# EAGLE board QS18-30-1 (EAGLE 6.1)
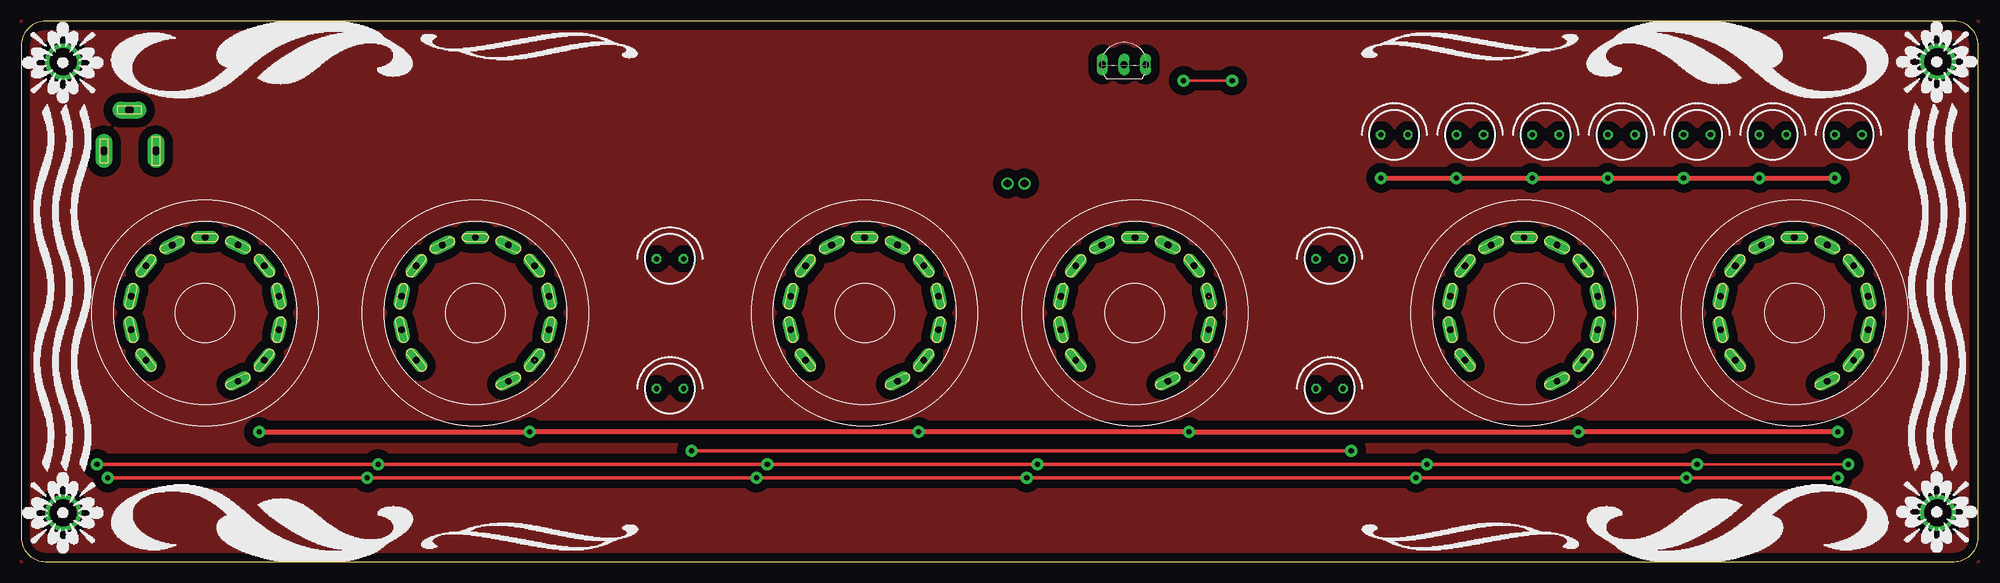
[diagram p1: board, top side]
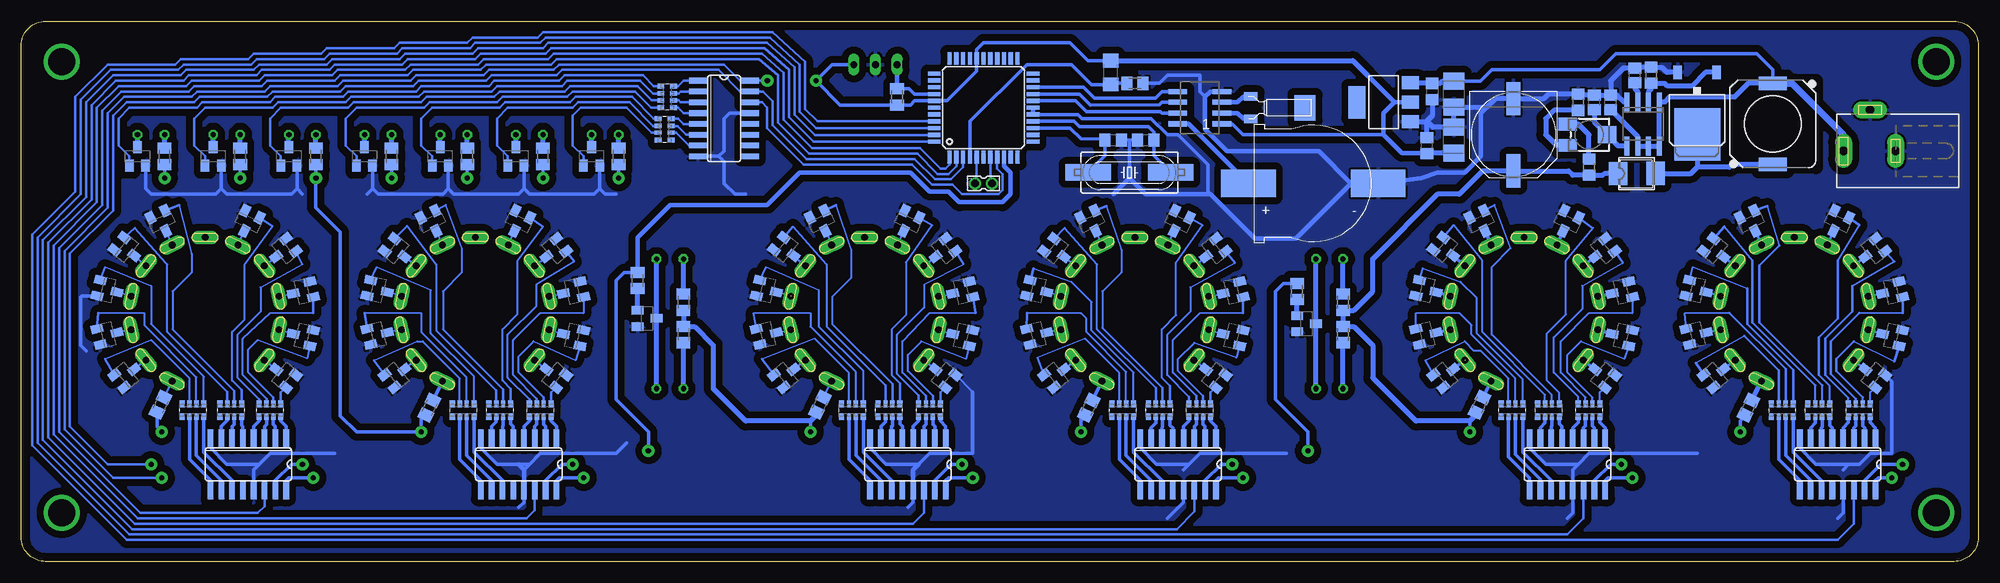
[diagram p2: board, bottom side, seen from below]

Size 229.87 x 63.5 mm. Coordinates in mm from the lower left corner, seen from the top.
Outline: 2.84,0 227.03,0 arc90 229.87,2.84 229.87,60.66 arc90 227.03,63.5 2.84,63.5 arc90 0,60.66 0,2.84 arc90 2.84,0
Copper layers (1*16): Top 0.035mm / dielectric 1.5mm / Bottom 0.035mm
Design rules: minimum track width 6mil, minimum drill 0.6mm, track to track 6mil, track to pad 10mil, pad to pad 10mil, via to via 10mil, smd to smd 6mil, copper to edge 40mil, drill to drill 8mil, minimum pad ring 10mil, minimum via ring 8mil, stop-mask expansion 4mil, vias tented up to drill 0.8mm, thermal gap 10mil
bRestrict: area 19.1,46.4 to 29.2,56.5

## Footprints (pad centres in the part's own frame; a part is rotated, then mirrored left to right if it is on the bottom)
C0805 = smd 1.3 x 1.5: 1 -0.85,0; 2 0.85,0
C1206 = smd 1.6 x 1.8: 1 -1.4,0; 2 1.4,0
C0805' = smd 1.3 x 1.5: 1 -0.95,0; 2 0.95,0
B/3528-21R = smd 1.95 x 2.5: + 1.525,0; - -1.525,0
PANASONIC_G = smd 3.9 x 1.6: + 4.25,0; - -4.25,0
SMB = smd 2.159 x 2.743: 1 -2.311,-0.127; 2 2.108,-0.102
SO16 = smd 0.66 x 2.032: 1 -4.445,-3.073; 2 -3.175,-3.073; 3 -1.905,-3.073; 4 -0.635,-3.073; 5 0.635,-3.073; 6 1.905,-3.073; 7 3.175,-3.073; 8 4.445,-3.073; 9 4.445,3.073; 10 3.175,3.073; 11 1.905,3.073; 12 0.635,3.073; 13 -0.635,3.073; 14 -1.905,3.073; 15 -3.175,3.073; 16 -4.445,3.073
SOIC8 = smd 0.6 x 2.2: 1 -1.905,-2.6; 2 -0.635,-2.6; 3 0.635,-2.6; 4 1.905,-2.6; 5 1.905,2.6; 6 0.635,2.6; 7 -0.635,2.6; 8 -1.905,2.6
DCJ0303 = drill 1 pad 2 long: 1 0,3.1; 2 4.8,0; 3 0,-3
DR1033 = smd 3.3 x 1.6: 1 0,4.768; 2 0,-4.768
TQFP44 = smd 1.5 x 0.5: 1 -5.8,4; 2 -5.8,3.2; 3 -5.8,2.4; 4 -5.8,1.6; 5 -5.8,0.8; 6 -5.8,0; 7 -5.8,-0.8; 8 -5.8,-1.6; 9 -5.8,-2.4; 10 -5.8,-3.2; 11 -5.8,-4; 23 5.8,-4; 24 5.8,-3.2; 25 5.8,-2.4; 26 5.8,-1.6; 27 5.8,-0.8; 28 5.8,0; 29 5.8,0.8; 30 5.8,1.6; 31 5.8,2.4; 32 5.8,3.2; 33 5.8,4 | smd 0.5 x 1.5: 12 -4,-5.8; 13 -3.2,-5.8; 14 -2.4,-5.8; 15 -1.6,-5.8; 16 -0.8,-5.8; 17 0,-5.8; 18 0.8,-5.8; 19 1.6,-5.8; 20 2.4,-5.8; 21 3.2,-5.8; 22 4,-5.8; 34 4,5.8; 35 3.2,5.8; 36 2.4,5.8; 37 1.6,5.8; 38 0.8,5.8; 39 0,5.8; 40 -0.8,5.8; 41 -1.6,5.8; 42 -2.4,5.8; 43 -3.2,5.8; 44 -4,5.8
IN-3 = drill 0.6 octagon: A -1.587,0; K 1.587,0
HC49UP = smd 5.334 x 1.93: 1 -4.826,0; 2 4.826,0
D-PAK_TO252AA = smd 1 x 1.6: 1 -2.28,-4.8; 3 2.28,-4.8 | smd 5.4 x 6.2: 4 0,2.5
EXB38V = smd 0.6 x 0.8: 1 -1.275,-0.75; 4 1.275,-0.75; 5 1.275,0.75; 8 -1.275,0.75 | smd 0.5 x 0.8: 2 -0.4,-0.75; 3 0.4,-0.75; 6 0.4,0.75; 7 -0.4,0.75
M0805 = smd 1.3 x 1.6: 1 -0.95,0; 2 0.95,0
R0805 = smd 1.3 x 1.5: 1 -0.95,0; 2 0.95,0
RTRIM3374 = smd 1.5 x 2.2: 1 -1.25,-2.5; 3 1.25,-2.5 | smd 1.98 x 2.17: 2 0,2.1
SOT223 = smd 1.499 x 2.007: 1 -2.261,-3.15; 2 0.025,-3.15; 3 2.311,-3.15 | smd 3.81 x 2.007: 4 0,3.15
SOT23-BEC = smd 1 x 1.4: B -0.95,-1.1; C 0,1.1; E 0.95,-1.1
QS30-1_V3 = drill 0.8 pad 1.6 long: 0 6.948,-5.546; 1 -6.948,-5.546; 2 -8.669,-1.97; 3 -8.669,1.97; 4 -6.948,5.546; 5 -3.869,8.004; 6 3.869,8.004; 7 6.948,5.546; 8 8.669,1.97; 9 8.669,-1.97; A 3.869,-8.004; NC 0,8.89
SOP08 = smd 0.6 x 2.2: 1 -1.905,-2.6; 2 -0.635,-2.6; 3 0.635,-2.6; 4 1.905,-2.6; 5 1.905,2.6; 6 0.635,2.6; 7 -0.635,2.6; 8 -1.905,2.6
1220BATTERY = smd 6.452 x 3.251: + -6.985,0; - 8.255,0
MS1V-T1K = smd 1.6 x 1: P$1 2.9,1.3; P$2 2.9,-1.3 | smd 2.5 x 3: P$3 -3.45,0
TO92- = drill 0.813 long: 1 2.54,0; 2 0,0; 3 -2.54,0
332-02 = drill 0.9 pad 1.27: 1 0,-1; 2 0,1

## Placement (x,y rotation side)
C1  [C0805]  40.32,57.15 90 bottom
C2  [C0805]  43.18,53.98 90 bottom
C3  [C0805]  45.09,53.98 90 bottom
C4  [C1206]  101.92,57.47 90 bottom
C5  [C0805']  101.6,49.53 0 bottom
C6  [C0805']  97.79,49.53 0 bottom
C7  [B/3528-21R]  61.59,54.93 90 bottom
C8  [C0805']  64.14,55.24 270 bottom
C9  [B/3528-21R]  61.59,49.53 270 bottom
C10  [C0805']  64.77,48.9 90 bottom
C11  [PANASONIC_G]  54.61,50.16 270 bottom
D1  [SMB]  40.01,45.72 0 bottom
IC1  4017D  [SO16]  16.51,11.43 180 bottom
IC2  4017D  [SO16]  48.26,11.43 180 bottom
IC3  4017D  [SO16]  93.98,11.43 180 bottom
IC4  4017D  [SO16]  125.73,11.43 180 bottom
IC5  4017D  [SO16]  171.45,11.43 180 bottom
IC6  4017D  [SO16]  203.2,11.43 180 bottom
IC7  MC34063AD  [SOIC8]  39.37,51.44 180 bottom
IC9  4017D  [SO16]  147.32,52.07 270 bottom
J1  [DCJ0303]  12.7,48.26 90 bottom
L2  [DR1033]  24.13,51.44 0 bottom
MCU1  AT89S51-33P  [TQFP44]  116.84,53.34 90 bottom
N1  IN-3  [IN-3]  153.67,35.56 0 top
N2  IN-3  [IN-3]  76.2,20.32 0 top
N3  IN-3  [IN-3]  153.67,20.32 0 top
N4  IN-3  [IN-3]  76.2,35.56 0 top
N5  IN-3  [IN-3]  214.63,50.16 0 top
N6  IN-3  [IN-3]  205.74,50.16 0 top
N7  IN-3  [IN-3]  196.85,50.16 0 top
N8  IN-3  [IN-3]  187.96,50.16 0 top
N9  IN-3  [IN-3]  179.07,50.16 0 top
N10  IN-3  [IN-3]  170.18,50.16 0 top
N11  Mon  [IN-3]  161.29,50.16 0 top
Q1  [HC49UP]  99.69,45.72 0 bottom
Q3  IRFR5305  [D-PAK_TO252AA]  33.02,52.7 180 bottom
R1  [EXB38V]  13.97,17.78 180 bottom
R2  [EXB38V]  18.73,17.78 180 bottom
R3  [EXB38V]  23.02,17.78 180 bottom
R4  [EXB38V]  45.72,17.78 180 bottom
R5  [M0805]  26.99,18.1 244.2 bottom
R6  [M0805]  58.58,18.41 244.2 bottom
R7  [M0805]  152.08,26.67 90 bottom
R8  [M0805]  152.08,30.48 270 bottom
R9  [M0805]  74.61,26.67 90 bottom
R10  [M0805]  74.61,30.48 270 bottom
R11  [R0805]  45.72,46.35 270 bottom
R12  [R0805]  46.99,53.98 270 bottom
R13  [R0805]  38.42,57.15 270 bottom
R14  [M0805]  104.46,18.1 244.2 bottom
R15  [M0805]  136.05,18.41 244.2 bottom
R16  [EXB38V]  50.48,17.78 180 bottom
R17  [EXB38V]  54.77,17.78 180 bottom
R18  [EXB38V]  91.44,17.78 180 bottom
R19  [EXB38V]  96.2,17.78 180 bottom
R20  [M0805]  80.01,31.75 90 bottom
R21  [M0805]  157.48,33.02 90 bottom
R22  [M0805]  99.06,56.2 180 bottom
R23  [RTRIM3374]  45.72,50.16 270 bottom
R24  [EXB38V]  100.49,17.78 180 bottom
R25  [EXB38V]  123.19,17.78 180 bottom
R26  [EXB38V]  127.95,17.78 180 bottom
R27  [EXB38V]  132.24,17.78 180 bottom
R28  [M0805]  181.93,18.1 244.2 bottom
R29  [M0805]  213.52,18.41 244.2 bottom
R30  [EXB38V]  168.91,17.78 180 bottom
R31  [EXB38V]  173.67,17.78 180 bottom
R32  [EXB38V]  177.96,17.78 180 bottom
R33  [EXB38V]  200.66,17.78 180 bottom
R34  [EXB38V]  205.26,17.78 180 bottom
R35  [EXB38V]  209.71,17.78 180 bottom
R36  [M0805]  213.04,47.62 270 bottom
R37  [M0805]  204.15,47.62 270 bottom
R38  [M0805]  195.26,47.62 270 bottom
R39  [M0805]  186.37,47.62 270 bottom
R40  [M0805]  177.48,47.62 270 bottom
R41  [M0805]  168.59,47.62 270 bottom
R42  [M0805]  159.7,47.62 270 bottom
R43  [EXB38V]  153.99,54.61 270 bottom
R44  [EXB38V]  154.31,50.8 270 bottom
R45  [M0805]  127,54.61 270 bottom
REG2  REG1117  [SOT223]  69.85,53.98 90 bottom
T1  [SOT23-BEC]  30.8,21.91 308.6 bottom
T2  [SOT23-BEC]  12.38,21.91 51.4 bottom
T3  [SOT23-BEC]  10.16,26.51 77.2 bottom
T4  [SOT23-BEC]  10.16,31.75 102.8 bottom
T5  [SOT23-BEC]  12.38,36.51 128.6 bottom
T6  [SOT23-BEC]  16.51,39.85 154.2 bottom
T7  [SOT23-BEC]  26.67,39.85 205.8 bottom
T8  [SOT23-BEC]  30.8,36.51 231.4 bottom
T9  [SOT23-BEC]  33.02,31.91 257.2 bottom
T10  [SOT23-BEC]  33.02,26.67 282.8 bottom
T11  [SOT23-BEC]  62.55,21.91 308.6 bottom
T12  [SOT23-BEC]  44.13,21.91 51.4 bottom
T13  [SOT23-BEC]  41.91,26.51 77.2 bottom
T14  [SOT23-BEC]  41.91,31.75 102.8 bottom
T15  [SOT23-BEC]  44.13,36.51 128.6 bottom
T16  [SOT23-BEC]  48.26,39.85 154.2 bottom
T17  [SOT23-BEC]  58.42,39.85 205.8 bottom
T18  [SOT23-BEC]  62.55,36.67 231.4 bottom
T19  [SOT23-BEC]  64.77,31.91 257.2 bottom
T20  [SOT23-BEC]  64.77,26.67 282.8 bottom
T21  [SOT23-BEC]  108.27,21.91 308.6 bottom
T22  [SOT23-BEC]  89.85,21.91 51.4 bottom
T23  [SOT23-BEC]  87.63,26.51 77.2 bottom
T24  [SOT23-BEC]  87.63,31.75 102.8 bottom
T25  [SOT23-BEC]  89.85,36.51 128.6 bottom
T26  [SOT23-BEC]  93.98,39.85 154.2 bottom
T27  [SOT23-BEC]  104.14,39.85 205.8 bottom
T28  [SOT23-BEC]  108.27,36.51 231.4 bottom
T29  [SOT23-BEC]  110.49,31.91 257.2 bottom
T30  [SOT23-BEC]  110.49,26.67 282.8 bottom
T31  [SOT23-BEC]  140.02,21.91 308.6 bottom
T32  [SOT23-BEC]  121.6,21.91 51.4 bottom
T33  [SOT23-BEC]  119.38,26.51 77.2 bottom
T34  [SOT23-BEC]  119.38,31.75 102.8 bottom
T35  [SOT23-BEC]  121.6,36.51 128.6 bottom
T36  [SOT23-BEC]  125.73,39.85 154.2 bottom
T37  [SOT23-BEC]  135.89,39.85 205.8 bottom
T38  [SOT23-BEC]  140.02,36.67 231.4 bottom
T39  [SOT23-BEC]  142.24,31.91 257.2 bottom
T40  [SOT23-BEC]  142.24,26.67 282.8 bottom
T41  [SOT23-BEC]  185.74,21.91 308.6 bottom
T42  [SOT23-BEC]  167.32,21.91 51.4 bottom
T43  [SOT23-BEC]  165.1,26.51 77.2 bottom
T44  [SOT23-BEC]  165.1,31.75 102.8 bottom
T45  [SOT23-BEC]  167.32,36.51 128.6 bottom
T46  [SOT23-BEC]  171.45,39.85 154.2 bottom
T47  [SOT23-BEC]  181.61,39.85 205.8 bottom
T48  [SOT23-BEC]  185.74,36.51 231.4 bottom
T49  [SOT23-BEC]  187.96,31.91 257.2 bottom
T50  [SOT23-BEC]  187.96,26.67 282.8 bottom
T51  [SOT23-BEC]  217.49,21.91 308.6 bottom
T52  [SOT23-BEC]  199.07,21.91 51.4 bottom
T53  [SOT23-BEC]  196.85,26.51 77.2 bottom
T54  [SOT23-BEC]  196.85,31.75 102.8 bottom
T55  [SOT23-BEC]  199.07,36.51 128.6 bottom
T56  [SOT23-BEC]  203.2,39.85 154.2 bottom
T57  [SOT23-BEC]  213.36,39.85 205.8 bottom
T58  [SOT23-BEC]  217.49,36.67 231.4 bottom
T59  [SOT23-BEC]  219.71,31.91 257.2 bottom
T60  [SOT23-BEC]  219.71,26.67 282.8 bottom
T61  [SOT23-BEC]  78.9,27.94 270 bottom
T62  [SOT23-BEC]  156.37,28.57 270 bottom
T63  [SOT23-BEC]  216.22,47.62 0 bottom
T64  [SOT23-BEC]  207.33,47.62 0 bottom
T65  [SOT23-BEC]  198.44,47.62 0 bottom
T66  [SOT23-BEC]  189.55,47.62 0 bottom
T67  [SOT23-BEC]  180.66,47.62 0 bottom
T68  [SOT23-BEC]  171.77,47.62 0 bottom
T69  [SOT23-BEC]  162.88,47.62 0 bottom
TUBE1  QS30-1R1  [QS30-1_V3]  21.59,29.21 0 top
TUBE2  QS30-1R1  [QS30-1_V3]  53.34,29.21 0 top
TUBE3  QS30-1R1  [QS30-1_V3]  99.06,29.21 0 top
TUBE4  QS30-1R1  [QS30-1_V3]  130.81,29.21 0 top
TUBE5  QS30-1R1  [QS30-1_V3]  176.53,29.21 0 top
TUBE6  QS30-1R1  [QS30-1_V3]  208.28,29.21 0 top
U$1  DS1302SOP08  [SOP08]  91.44,53.34 90 bottom
U$2  1220BATTERY_SF  [1220BATTERY]  78.74,44.45 0 bottom
U$3  MS1V-T1K-6P  [MS1V-T1K]  82.55,53.34 180 bottom
U$4  HX1838  [TO92-]  129.54,58.42 0 top
X1  [332-02]  116.84,44.45 270 bottom

## Tracks (layer width: path | path; a pad name or v marks a point on that pad's centre or on a via)
170V  (via drill 0.6 pad 1.42)
  Top 0.61: v213.36,15.24 v182.88,15.24 v137.16,15.24 v105.41,15.24 v59.69,15.24 v27.94,15.24 | v213.04,45.09 v204.15,45.09 v195.26,45.09 v186.37,45.09 v177.48,45.09 v168.59,45.09 v159.7,45.09
  Bottom 0.406: R29.2 213.93,15.81 v213.36,15.24 | R28.2 182.88,16.7 v182.88,15.24 190.5,15.24 192.41,17.14 192.41,38.73 195.26,41.59 v195.26,45.09 R38.2 | 137.16,16.51 v137.16,15.24 | 105.41,16.51 105.41,16.7 R14.2 104.87,17.05 105.41,16.51 | 105.41,16.51 v105.41,15.24 | v59.69,15.24 59.69,16.51 | R5.2 27.4,17.05 27.94,16.51 v27.94,15.24 | v204.15,45.09 R37.2 | v213.04,45.09 R36.2 | R39.2 v186.37,45.09 | R40.2 v177.48,45.09 | R41.2 v168.59,45.09 | R42.2 v159.7,45.09
  Bottom 0.61: D1.1 43.94,45.59 44.13,45.4 44.13,45.41 R11.2 47.63,45.41 48.14,45.91 C11.+ 58.23,45.91 60.96,43.18 63.5,43.18 71.12,35.56 71.12,31.75 73.34,29.53 R10.2 R9.2 73.34,27.62 71.12,25.4 71.12,21.59 66.04,16.51 59.69,16.51 58.99,17.21 R6.2 | R8.2 R7.2 150.81,27.62 148.59,25.4 148.59,20.32 144.78,16.51 137.16,16.51 136.46,17.21 R15.2
+5V  (via drill 0.6 pad 1.42)
  Top 0.305: v142.24,56.52 v136.53,56.52
  Top 0.406: v213.36,9.84 v195.58,9.84 v163.83,9.84 v118.11,9.84 v86.36,9.84 v40.64,9.84 v10.16,9.84
  Bottom 0.305: v142.24,56.52 IC9.16 145.41,56.52 147.32,58.42 166.69,58.42 167.32,57.78 174.94,57.78 175.58,57.15 183.51,57.15 184.15,56.52 192.09,56.52 192.72,55.88 200.66,55.88 201.29,55.24 209.23,55.24 209.87,54.61 217.81,54.61 219.71,52.7 219.71,41.59 224.79,36.51 224.79,15.56 219.07,9.84 v213.36,9.84
  Bottom 0.406: U$1.1 87.63,51.44 86.36,50.16 69.85,50.16 | IC6.16 198.75,9.53 198.44,9.84 v195.58,9.84 | IC5.16 167,9.53 166.69,9.84 v163.83,9.84 | v10.16,9.84 11.75,9.84 12.06,9.53 IC1.16 | IC2.16 43.81,9.53 43.5,9.84 v40.64,9.84 | IC3.16 89.53,9.53 89.22,9.84 v86.36,9.84 | IC4.16 121.28,9.53 120.97,9.84 v118.11,9.84 | C4.2 104.59,58.87 106.68,60.96 116.84,60.96 117.64,60.16 MCU1.29 117.64,57.62 121.12,54.14 MCU1.38 124.93,54.14 125.41,53.66 125.42,53.66 R45.2 133.67,53.66 v136.53,56.52 134.62,58.42 U$4.1
  Bottom 0.508: 64.71,48.01 67.69,48.01 69.85,50.16 69.85,52.7 68.56,54 | REG2.2 68.56,54 | 71.75,57.15 70.48,55.88 69.85,55.3 68.56,54
  Bottom 0.61: C9.+ 64.71,48.01 C10.1 | C4.2 73.47,58.87 71.75,57.15
+12V
  Bottom 0.406: L2.1 24.13,57.78 26.04,59.69 42.55,59.69 44.45,57.78 57.15,57.78 58.48,56.45 C7.+
  Bottom 0.61: C2.1 40.01,49.95 IC7.6 IC7.7 IC7.8 IC7.1 36.77,54.03 36.2,54.61 28.57,54.61 26.98,56.2 L2.1 | C7.+ 62.93,56.45 63.19,56.2 C8.1 66.61,56.2 REG2.3
  Bottom 0.813: J1.1 15.8,50.09 21.91,56.2 L2.1
CLK_D0
  Bottom 0.305: IC9.14 142.88,53.98 142.24,53.34 142.24,50.96 137.95,46.67 125.25,46.67 122.87,44.29 120.49,44.29 119.38,43.18 115.09,43.18 114.62,43.66 114.62,45.56 115.24,46.18 MCU1.8
CLK_H0
  Bottom 0.305: IC1.14 14.61,4.45 16.51,2.54 217.49,2.54 228.6,13.65 228.6,38.42 223.52,43.5 223.52,54.61 219.71,58.42 211.77,58.42 211.14,59.05 203.2,59.05 202.56,59.69 194.63,59.69 193.99,60.33 186.06,60.33 185.42,60.96 177.48,60.96 176.85,61.59 169.23,61.59 168.59,62.23 141.6,62.23 137.79,58.74 137.79,53.18 136.35,51.74 MCU1.41
CLK_H1
  Bottom 0.305: IC2.14 46.35,5.08 48.26,3.17 217.17,3.17 227.97,13.97 227.97,38.1 222.88,43.18 222.88,54.29 219.39,57.78 211.46,57.78 210.82,58.42 202.88,58.42 202.25,59.05 194.31,59.05 193.68,59.69 185.74,59.69 185.1,60.33 177.16,60.33 176.53,60.96 168.91,60.96 168.28,61.59 141.92,61.59 138.43,58.42 138.43,52.86 136.51,50.94 MCU1.42
CLK_M0
  Bottom 0.305: IC3.14 92.08,5.87 94.14,3.81 216.85,3.81 227.33,14.29 227.33,37.78 222.25,42.86 222.25,53.98 219.07,57.15 211.14,57.15 210.5,57.78 202.56,57.78 201.93,58.42 193.99,58.42 193.36,59.05 185.42,59.05 184.78,59.69 176.85,59.69 176.21,60.33 168.59,60.33 167.96,60.96 142.24,60.96 139.06,58.1 139.06,52.55 136.66,50.14 MCU1.43
CLK_M1
  Bottom 0.305: IC4.14 123.83,5.71 125.09,4.45 216.53,4.45 226.69,14.61 226.69,37.47 221.62,42.55 221.62,53.66 218.76,56.52 210.82,56.52 210.19,57.15 202.25,57.15 201.61,57.78 193.68,57.78 193.04,58.42 185.1,58.42 184.47,59.05 176.53,59.05 175.9,59.69 168.28,59.69 167.64,60.33 142.56,60.33 139.7,57.78 139.7,52.23 136.81,49.34 MCU1.44
CLK_S0
  Bottom 0.305: IC5.14 169.54,6.03 170.5,5.08 216.22,5.08 226.06,14.92 226.06,37.15 220.98,42.23 220.98,53.34 218.44,55.88 210.5,55.88 209.87,56.52 201.93,56.52 201.29,57.15 193.36,57.15 192.72,57.78 184.78,57.78 184.15,58.42 176.21,58.42 175.58,59.05 167.96,59.05 167.32,59.69 142.88,59.69 140.34,57.47 140.34,51.91 137,48.58 124.3,48.58 121.92,46.2 121.28,46.2 120.84,46.64 MCU1.1
CLK_S1
  Bottom 0.305: IC6.14 201.29,6.51 202.09,5.71 215.9,5.71 225.43,15.24 225.43,36.83 220.34,41.91 220.34,53.02 218.12,55.24 210.19,55.24 209.55,55.88 201.61,55.88 200.98,56.52 193.04,56.52 192.41,57.15 184.47,57.15 183.83,57.78 175.9,57.78 175.26,58.42 167.64,58.42 167,59.05 143.19,59.05 140.97,57.15 140.97,51.59 137.32,47.94 124.62,47.94 122.24,45.56 120.97,45.56 120.04,46.49 MCU1.2
CS
  Bottom 0.406: MCU1.20 105.11,55.74 103.82,54.45 96.66,54.47 95.89,55.24 U$1.5
DAY0
  Bottom 0.305: T63.B 217.17,47.62 218.44,48.9 218.44,52.07 217.17,53.34 209.23,53.34 208.6,53.98 200.66,53.98 200.03,54.61 192.09,54.61 191.45,55.24 183.51,55.24 182.88,55.88 174.94,55.88 174.31,56.52 166.69,56.52 166.05,57.15 156.84,57.15 155.58,55.88 R43.1
DAY1
  Bottom 0.305: T64.B 208.28,47.62 209.55,48.9 209.55,52.07 208.28,53.34 200.34,53.34 199.71,53.98 191.77,53.98 191.13,54.61 183.2,54.61 182.56,55.24 174.62,55.24 173.99,55.88 166.37,55.88 165.74,56.52 157.16,56.52 155.66,55.01 R43.2
DAY2
  Bottom 0.305: T65.B 199.39,47.62 200.66,48.9 200.66,52.07 199.39,53.34 191.45,53.34 190.82,53.98 182.88,53.98 182.25,54.61 174.31,54.61 173.67,55.24 166.05,55.24 165.42,55.88 157.48,55.88 155.81,54.21 R43.3
DAY3
  Bottom 0.305: T66.B 190.5,47.62 191.77,48.9 191.77,52.07 190.5,53.34 182.56,53.34 181.93,53.98 173.99,53.98 173.35,54.61 165.74,54.61 165.1,55.24 157.8,55.24 155.89,53.34 R43.4
DAY4
  Bottom 0.305: T67.B 181.61,47.62 182.88,48.9 182.88,52.07 181.61,53.34 173.67,53.34 173.04,53.98 165.42,53.98 164.78,54.61 158.12,54.61 155.58,52.08 R44.1
DAY5
  Bottom 0.305: T68.B 172.72,47.62 173.99,48.9 173.99,52.07 172.72,53.34 165.1,53.34 164.47,53.98 158.43,53.98 155.66,51.2 R44.2
DAY6
  Bottom 0.305: T69.B 163.83,47.62 165.1,48.9 165.1,52.39 164.15,53.34 158.75,53.34 155.81,50.4 R44.3
DOT  (via drill 0.6 pad 1.42)
  Top 0.406: v78.74,13.02 v156.21,13.02
  Bottom 0.406: R20.2 81.6,32.7 82.55,31.75 82.55,19.05 78.74,15.24 v78.74,13.02 | v156.21,13.02 156.21,15.24 160.02,19.05 160.02,33.02 159.07,33.97 R21.2
  Bottom 0.508: MCU1.9 114.44,46.49 113.67,45.72 113.67,43.18 114.62,42.23 119.7,42.23 120.97,43.5 123.19,43.5 125.41,45.72 138.43,45.72 142.24,41.91 153.67,41.91 157.48,38.1 R21.2
GND
  Bottom 0.254: 118.11,19.92 T32.E
  Bottom 0.406: IC2.8 52.7,13.34 50.8,11.43 46.99,11.43 | 46.99,11.43 45.72,12.7 33.02,12.7 | IC3.8 98.42,13.34 96.52,11.43 92.71,11.43 | 92.71,11.43 91.44,12.7 81.28,12.7 | IC4.8 130.18,13.34 128.27,11.43 124.46,11.43 123.19,12.7 118.11,12.7 118.11,19.92 | IC6.8 207.65,13.34 205.74,11.43 201.93,11.43 | 201.93,11.43 200.66,12.7 193.04,12.7 | IC5.8 175.9,13.34 173.99,11.43 171.45,11.43 170.18,11.43 | 170.18,11.43 168.91,12.7 160.02,12.7 158.75,13.97 | 147.96,47.62 147.32,46.99 147.32,44.45 146.05,43.18 144.78,43.18 | 99.69,49.53 C5.2 | C6.1 99.69,49.53 | 99.69,49.53 99.69,45.09 | MCU1.16 105.73,52.54 105.25,52.07 97.16,52.07 95.25,50.16 93.98,50.16 90.49,46.67 90.49,43.5 90.17,43.18 | IC1.8 20.95,13.34 19.05,11.43 15.24,11.43 | 15.24,11.43 13.97,11.43 12.7,12.7 10.16,12.7 10.16,21.19 T2.E | T69.E 161.93,43.82 | 161.93,43.82 161.29,43.18 160.02,43.18 | T68.E 170.82,43.82 | 170.82,43.82 170.18,43.18 162.56,43.18 161.93,43.82 | T67.E 179.71,43.82 | 179.71,43.82 179.07,43.18 171.46,43.18 170.82,43.82 | T66.E 188.6,43.82 | 188.6,43.82 187.96,43.18 180.34,43.18 179.71,43.82 | T65.E 197.49,43.82 | 197.49,43.82 196.85,43.18 | 189.24,43.18 188.6,43.82 | T64.E 206.38,43.82 | 206.38,43.82 205.74,43.18 198.12,43.18 197.49,43.82 | T63.E 215.27,43.82 214.63,43.18 207.01,43.18 206.38,43.82 | R22.1 96.2,56.2 95.25,57.15 91.44,57.15 91.44,55.24 90.81,54.61 | 46.99,11.43 47.62,10.79 IC2.13 47.62,5.71 48.26,5.08 | 15.88,10.79 15.24,11.43 | 93.34,10.79 92.71,11.43 | 170.81,10.79 170.18,11.43 | IC6.13 202.56,10.79 201.93,11.43 | IC9.8 147.96,47.62 | IC9.13 146.69,52.7 147.32,52.07 147.32,48.26 147.96,47.62 | T59.E 222.77,31.23 222.88,31.11 222.88,25.4 222.25,24.77
  Bottom 0.406: IC4.13 125.09,6.99 125.73,6.35 | IC5.13 170.81,6.99 171.45,6.35 | IC3.13 93.34,6.99 95.25,5.08 | IC1.13 15.88,5.71 16.51,5.08
  Bottom 0.508: 57.72,53.4 58.42,52.7 58.42,47.62 60.33,45.72 63.5,45.72 65.41,45.09 U$2.- 73.66,44.45 | U$1.4 90.17,55.24 90.81,54.61 90.81,50.8 88.27,48.26 77.47,48.26 73.66,44.45 | 73.66,44.45 80.17,37.94 84.93,37.94 90.17,43.18 97.79,43.18 99.69,45.09 101.6,43.18 | MCU1.16 MCU1.17 | IC5.13 170.81,10.79 171.45,11.43 | IC4.13 125.09,10.79 124.46,11.43
  Bottom 0.61: C2.2 C3.2 46.89,54.83 R12.1 50.48,54.92 50.99,54.41 C11.- 56.71,54.41 57.72,53.4 C7.- C9.- 64.07,51.05 64.77,51.75 | C2.2 42.44,54.83 41.65,54.03 IC7.4 | C2.2 43.18,56.52 41.7,58 C1.2 40.22,58.1 R13.1 37.15,58.1 36.55,57.51 Q3.3 | C8.2 64.14,52.39 64.77,51.75 | REG2.1 64.81,51.71 | 64.77,51.75 64.81,51.71 | C10.2 64.77,51.68 64.81,51.71
  pour Bottom (isolate 0.813): 0,63.5 229.87,63.5 229.87,0 0,0
N$1
  Bottom 0.406: C5.1 102.55,47.69 Q1.1 | MCU1.14 106.66,50.94 105.41,49.69 102.69,49.67
  Bottom 0.508: 102.69,49.67 C5.1
N$2
  Bottom 0.406: MCU1.15 106.22,51.74 105.57,51.12 97.47,51.12 96.84,50.48 C6.2 96.84,47.69 Q1.2
N$3
  Bottom 0.254: R1.1 12.7,19.9 T2.B
N$4
  Bottom 0.203: 9.84,23.5 14.61,25.88
  Bottom 0.254: R1.2 13.57,19.29
  Bottom 0.305: T3.B 9.84,23.5 | 13.57,19.29 16.67,22.38 16.67,23.81 14.61,25.88
N$5
  Bottom 0.203: 8.89,29.21 13.97,29.21
  Bottom 0.254: R1.3 14.37,19.13
  Bottom 0.305: T4.B 8.89,29.21 | 13.97,29.21 17.3,25.88 17.3,22.07 14.37,19.13
N$6
  Bottom 0.254: R4.1 44.45,19.9 T12.B
N$7
  Bottom 0.203: 9.84,35.24 14.76,32.38
  Bottom 0.254: R1.4 15.24,19.21 17.94,21.91
  Bottom 0.305: T5.B 9.84,35.24 | 14.76,32.38 14.76,29.37 17.94,26.19 17.94,21.91
N$8
  Bottom 0.203: 13.97,39.53 16.51,35.4
  Bottom 0.254: R2.1 17.46,20.63 18.73,21.91
  Bottom 0.305: T6.B 13.97,39.53 | 18.73,21.91 18.73,26.35 16.51,28.57 16.51,35.4
N$9
  Bottom 0.203: 24.77,41.75 23.34,37.15
  Bottom 0.254: R2.2 18.33,20.71
  Bottom 0.305: T7.B 24.77,41.75 | 18.33,20.71 25.72,28.1 25.72,34.77 23.34,37.15
N$10
  Bottom 0.203: 29.84,39.37 26.51,35.4
  Bottom 0.254: R2.3 19.13,20.72
  Bottom 0.305: T8.B 29.84,39.37 | 26.51,35.4 26.51,28.1 19.13,20.72
N$11
  Bottom 0.203: 33.5,34.61 27.15,32.07
  Bottom 0.254: T9.B 33.5,34.61
  Bottom 0.305: R3.1 21.74,22.54 27.15,27.94 27.15,32.07
N$12
  Bottom 0.203: 34.45,29.21 29.21,29.21
  Bottom 0.254: T10.B 34.45,29.21
  Bottom 0.305: R3.2 22.62,22.62 29.21,29.21
N$13
  Bottom 0.203: 33.18,23.34 27.46,26.51
  Bottom 0.305: T1.B 33.18,23.34 | 27.46,26.51 23.42,22.47 R3.3
N$14
  Bottom 0.203: 41.59,23.81 46.67,25.88
  Bottom 0.254: T13.B 41.59,23.81 | R4.2 45.32,19.29 48.26,22.23 48.26,24.29 46.67,25.88
N$15
  Bottom 0.203: 40.64,29.21 45.72,29.21
  Bottom 0.254: T14.B 40.64,29.21 | R4.3 46.12,19.29 49.05,22.23 49.05,25.88 45.72,29.21
N$16
  Bottom 0.203: 41.75,35.08 46.51,32.38
  Bottom 0.254: T15.B 41.75,35.08 | R4.4 46.99,19.37 49.85,22.23 49.85,26.35 46.51,29.69 46.51,32.38
N$17
  Bottom 0.203: 45.24,39.21 48.42,35.4
  Bottom 0.254: T16.B 45.24,39.21 | R16.1 49.21,19.84 50.64,21.27 50.64,26.83 48.42,29.05 48.42,35.4
N$18
  Bottom 0.203: 56.83,41.91 54.93,36.83
  Bottom 0.254: R16.2 50.08,19.6 57.15,26.67 57.15,34.61 54.93,36.83 | T17.B 56.83,41.91
N$19
  Bottom 0.203: 61.59,39.53 58.26,35.4
  Bottom 0.254: T18.B 61.59,39.53 | R16.3 50.88,19.61 58.26,26.99 58.26,35.4
N$20
  Bottom 0.203: 65.25,34.45 60.8,32.86
  Bottom 0.254: T19.B 65.25,34.45 | R17.1 53.49,21.43 58.9,26.83 58.9,30.96 60.8,32.86
N$21
  Bottom 0.203: 66.04,29.21 60.96,29.21
  Bottom 0.254: T20.B 66.04,29.21 | R17.2 54.37,21.51 59.53,26.67 59.53,27.78 60.96,29.21
N$22
  Bottom 0.203: 64.93,23.65 60.33,25.88
  Bottom 0.254: T11.B 64.93,23.65 | R17.3 55.17,21.51 58.42,24.77 59.21,24.77 60.33,25.88
N$23
  Bottom 0.406: R14.1 TUBE3.A
N$24
  Bottom 0.254: R15.1 TUBE4.A
N$25
  Bottom 0.61: R5.1 TUBE1.A
N$26
  Bottom 0.305: R18.1 90.17,19.9 T22.B
N$27
  Bottom 0.406: R6.1 TUBE2.A
N$28
  Bottom 0.203: 87.15,23.97 92.08,25.72
  Bottom 0.254: T23.B 87.15,23.97 | 92.08,25.72 93.98,23.81 93.98,22.38 91.04,19.44
  Bottom 0.305: R18.2 91.04,19.44
N$29
  Bottom 0.203: 86.36,29.21 91.44,29.21
  Bottom 0.254: 91.84,19.45 94.61,22.23 94.61,26.04 91.44,29.21
  Bottom 0.305: R18.3 91.84,19.45 | T24.B 86.36,29.21
N$30
  Bottom 0.203: 87.31,35.08 92.55,32.23
  Bottom 0.254: 92.72,19.37 95.25,21.91 95.25,26.67 92.55,29.37 92.55,32.23 | T25.B 87.31,35.08
  Bottom 0.305: R18.4 92.72,19.37
N$31
  Bottom 0.203: 91.12,39.53 94.22,35.16
  Bottom 0.254: 94.93,20.63 95.89,21.59 95.89,27.3 94.22,28.97 94.22,35.16 | T26.B 91.12,39.53
  Bottom 0.305: R19.1 94.93,20.63
N$32
  Bottom 0.203: 102.39,41.75 100.65,36.67
  Bottom 0.254: 95.8,20.4 102.87,27.46 102.87,31.75 100.65,33.97 100.65,36.67
  Bottom 0.305: T27.B 102.39,41.75 | R19.2 95.8,20.4
N$33
  Bottom 0.203: 107.31,39.21 103.5,34.92
  Bottom 0.254: T28.B 107.31,39.21 | 96.6,20.4 103.5,27.3 103.5,34.92
  Bottom 0.305: R19.3 96.6,20.4
N$34
  Bottom 0.203: 110.97,34.45 106.52,32.86
  Bottom 0.254: R24.1 99.21,22.22 104.14,27.15 104.14,30.48 106.52,32.86
  Bottom 0.305: T29.B 110.97,34.45
N$35
  Bottom 0.203: 111.76,29.21 105.41,29.21
  Bottom 0.254: R24.2 100.09,22.3 104.78,26.99 104.78,28.57 105.41,29.21
  Bottom 0.305: T30.B 111.76,29.21
N$36
  Bottom 0.203: 110.49,23.97 104.93,26.19
  Bottom 0.254: T21.B 110.49,23.97 | R24.3 100.89,22.15 104.93,26.19
N$37
  Bottom 0.305: R25.1 121.92,19.9 T32.B
N$38
  Bottom 0.203: 118.9,23.81 124.14,25.88
  Bottom 0.254: 122.79,19.44 125.73,22.38 125.73,24.29 124.14,25.88 | T33.B 118.9,23.81
  Bottom 0.305: R25.2 122.79,19.44
N$39
  Bottom 0.203: 117.79,29.21 123.19,29.21
  Bottom 0.254: 123.59,19.45 126.36,22.23 126.36,25.88 123.19,29.21
  Bottom 0.305: T34.B 117.79,29.21 | R25.3 123.59,19.45
N$40
  Bottom 0.203: 119.22,34.92 123.83,32.54
  Bottom 0.254: T35.B 119.22,34.92 | 124.47,19.53 127,22.07 127,26.67 123.83,29.84 123.83,32.54
  Bottom 0.305: R25.4 124.47,19.53
N$41
  Bottom 0.203: 122.87,39.53 125.97,35.16
  Bottom 0.254: 126.68,20.95 127.64,21.91 127.64,27.3 125.97,28.97 125.97,35.16 | T36.B 122.87,39.53
  Bottom 0.305: R26.1 126.68,20.95
N$42
  Bottom 0.203: 134.14,41.91 132.4,36.67
  Bottom 0.254: 127.55,20.87 134.62,27.94 134.62,31.11 132.4,33.34 132.4,36.67
  Bottom 0.305: T37.B 134.14,41.91 | R26.2 127.55,20.87
N$43
  Bottom 0.203: 139.22,39.37 135.25,34.92
  Bottom 0.254: T38.B 139.22,39.37 | 128.35,20.72 135.25,27.62 135.25,34.92
  Bottom 0.305: R26.3 128.35,20.72
N$44
  Bottom 0.203: 142.4,34.61 136.21,31.91
  Bottom 0.254: T39.B 142.4,34.61 | 136.21,31.91 136.21,27.62 130.96,22.38 R27.1
N$45
  Bottom 0.203: 143.83,29.21 137.16,29.21
  Bottom 0.254: T40.B 143.83,29.21 | 137.16,29.21 137.16,27.62 131.84,22.3 R27.2
N$46
  Bottom 0.203: 142.88,23.81 136.68,26.19
  Bottom 0.254: T31.B 142.88,23.81 | R27.3 132.64,22.15 136.68,26.19
N$47
  Bottom 0.406: R18.8 90.17,16.5 89.53,15.88 IC3.1
N$48
  Bottom 0.406: R18.7 91.04,16.11 90.81,15.88 IC3.2
N$49
  Bottom 0.61: N3.A R7.1
N$50
  Bottom 0.61: R8.1 N1.A
N$51
  Bottom 0.61: N2.A R9.1
N$52
  Bottom 0.61: R10.1 N4.A
N$53
  Bottom 0.61: IC7.2 38.73,55.24 38.42,55.56 R13.2 36.83,56.2 36.51,55.88 33.66,55.88 32.03,57.51 Q3.1
N$54
  Bottom 0.305: MCU1.5 117.64,45.08 117.84,44.88 X1.1
N$55
  Bottom 0.61: C1.1 40.32,55.56 40.01,55.24 IC7.3
N$56
  Bottom 0.61: IC7.5 42.29,48.84 R23.2 45.09,51.63 C3.1
N$57
  Bottom 0.61: Q3.4 33.02,46.35 | D1.2 33.76,45.62 33.02,46.35 | 33.02,46.35 29.21,46.35 28.9,46.67 L2.2
N$58
  Bottom 0.406: R18.6 91.84,16.11 92.08,15.88 IC3.3
N$59
  Bottom 0.406: R18.5 92.72,16.5 93.34,15.88 IC3.4
N$60
  Bottom 0.406: R19.8 94.93,16.03 94.61,15.72 IC3.5
N$61
  Bottom 0.305: MCU1.7 116.04,45.09 116.05,45.09 115.84,44.88 X1.2
N$62
  Bottom 0.406: R19.7 95.8,15.8 95.89,15.72 IC3.6
N$63
  Bottom 0.406: R19.6 96.6,16.27 97.16,15.72 IC3.7
N$64
  Bottom 0.406: R24.6 100.89,11.99 98.42,9.53 IC3.9
N$65
  Bottom 0.406: R24.8 99.21,12.85 95.89,9.53 IC3.11
N$66
  Bottom 0.406: R24.7 100.09,12.46 97.16,9.53 IC3.10
N$67
  Bottom 0.406: R25.6 123.59,16.11 123.83,15.88 IC4.3
N$68
  Bottom 0.406: R25.8 121.92,16.5 121.28,15.88 IC4.1
N$69
  Bottom 0.406: R25.7 122.79,16.11 122.56,15.88 IC4.2
N$70
  Bottom 0.406: R27.8 130.96,12.85 127.64,9.53 IC4.11
N$71
  Bottom 0.406: IC4.9 130.18,9.53 132.64,11.99 R27.6
N$72
  Bottom 0.406: IC4.10 128.91,9.53 131.84,12.46 R27.7
N$73
  Bottom 0.406: R25.5 124.47,16.5 125.09,15.88 IC4.4
N$74
  Bottom 0.406: R26.8 126.68,16.19 126.36,15.88 IC4.5
N$75
  Bottom 0.406: R26.7 127.55,15.96 127.64,15.88 IC4.6
N$76
  Bottom 0.406: R26.6 128.35,16.43 128.91,15.88 IC4.7
N$77
  Bottom 0.406: R1.8 12.7,16.35 12.06,15.72 IC1.1
N$78
  Bottom 0.406: R1.7 13.57,15.95 13.34,15.72 IC1.2
N$79
  Bottom 0.406: R1.6 14.37,15.95 14.61,15.72 IC1.3
N$80
  Bottom 0.406: R1.5 15.24,16.35 15.88,15.72 IC1.4
N$81
  Bottom 0.406: R2.8 17.46,16.03 17.14,15.72 IC1.5
N$82
  Bottom 0.406: R2.7 18.33,15.8 18.41,15.72 IC1.6
N$83
  Bottom 0.406: R2.6 19.13,16.27 19.68,15.72 IC1.7
N$84
  Bottom 0.406: R3.8 21.74,12.85 18.41,9.53 IC1.11
N$85
  Bottom 0.406: R3.7 22.62,12.46 19.68,9.53 IC1.10
N$86
  Bottom 0.254: 181.26,21.62 TUBE5.A
  Bottom 0.406: TUBE5.A R28.1
N$87
  Bottom 0.406: IC1.9 20.95,9.53 23.42,11.99 R3.6
N$88
  Bottom 0.254: R29.1 TUBE6.A 213.01,21.62
N$89
  Bottom 0.61: N2.K 77.79,27.93 T61.C 77.8,35.55 N4.K
N$90
  Bottom 0.61: T61.B 80,30.79 R20.1
N$91
  Bottom 0.61: N3.K 155.26,28.56 T62.C 155.27,35.55 N1.K
N$92
  Bottom 0.61: T62.B 157.47,32.06 R21.1
N$93
  Bottom 0.406: R4.8 44.45,16.35 43.81,15.72 IC2.1
N$94
  Bottom 0.406: R4.7 45.32,15.95 45.09,15.72 IC2.2
N$95
  Bottom 0.406: R4.6 46.12,15.95 46.35,15.72 IC2.3
N$96
  Bottom 0.406: R4.5 46.99,16.35 47.62,15.72 IC2.4
N$97
  Bottom 0.406: R16.8 49.21,16.19 48.9,15.88 IC2.5
N$98
  Bottom 0.508: U$1.8 92.77,51.49 U$2.+
N$99
  Bottom 0.406: R16.7 50.08,15.96 50.16,15.88 IC2.6
N$100
  Bottom 0.406: R16.6 50.88,16.27 51.44,15.72 IC2.7
N$101
  Bottom 0.406: R17.8 53.49,12.85 50.16,9.53 IC2.11
N$102
  Bottom 0.406: IC2.10 51.44,9.68 54.37,12.62 R17.7
N$103
  Bottom 0.508: U$1.2 87,52.7 86.33,52.04 U$3.P$1
N$104
  Bottom 0.406: MCU1.4 118.44,51.74 111.76,58.42 106.52,58.42 104.17,56.07 C4.1 101.79,56.2 R22.2
N$105
  Bottom 0.508: U$1.3 87,53.98 86.33,54.64 U$3.P$2
N$106
  Bottom 0.406: IC2.9 52.7,9.84 55.17,12.31 R17.6
N$107
  Bottom 0.305: R30.1 167.63,19.9 T42.B
N$108
  Bottom 0.203: 164.78,23.65 169.7,25.88
  Bottom 0.254: 168.51,19.29 171.45,22.23 171.45,24.13 169.7,25.88 | T43.B 164.78,23.65
  Bottom 0.305: R30.2 168.51,19.29
N$109
  Bottom 0.203: 163.83,29.21 168.91,29.21
  Bottom 0.254: 169.31,19.13 172.09,21.91 172.09,26.04 168.91,29.21 | T44.B 163.83,29.21
  Bottom 0.305: R30.3 169.31,19.13
N$110
  Bottom 0.203: 164.94,35.24 169.39,32.54
  Bottom 0.254: 170.19,19.05 172.72,21.59 172.72,26.67 169.39,30 169.39,32.54 | T45.B 164.94,35.24
  Bottom 0.305: R30.4 170.19,19.05
N$111
  Bottom 0.203: 168.59,39.37 171.61,35.32
  Bottom 0.254: 173.35,21.27 173.35,27.3 171.61,29.05 171.61,35.32 | T46.B 168.59,39.37
  Bottom 0.305: R31.1 172.4,20.32 173.35,21.27
N$112
  Bottom 0.203: 180.02,41.91 178.12,36.83
  Bottom 0.254: T47.B 180.02,41.91 | 173.27,20.24 180.34,27.3 180.34,31.75 178.12,33.97 178.12,36.83
  Bottom 0.305: R31.2 173.27,20.24
N$113
  Bottom 0.203: 184.55,39.45 181.13,34.92
  Bottom 0.254: T48.B 184.55,39.45 | 181.13,34.92 181.13,27.15 174.07,20.09
  Bottom 0.305: R31.3 174.07,20.09
N$114
  Bottom 0.203: 188.12,34.61 181.77,31.91
  Bottom 0.254: R32.1 176.68,21.74 181.77,26.83 181.77,31.91 | T49.B 188.12,34.61
N$115
  Bottom 0.203: 189.55,29.21 182.88,29.21
  Bottom 0.254: R32.2 177.56,21.67 182.88,26.99 182.88,29.21
  Bottom 0.305: T50.B 189.55,29.21
N$116
  Bottom 0.203: 188.44,23.65 183.36,25.88
  Bottom 0.254: R32.3 178.36,21.51 182.72,25.88 183.36,25.88 | T41.B 188.44,23.65
N$117
  Bottom 0.254: 199.38,19.9 T52.B
  Bottom 0.305: R33.1 199.38,19.9
N$118
  Bottom 0.203: 196.29,23.89 202.09,26.04
  Bottom 0.254: 200.26,19.29 203.2,22.23 203.2,24.92 202.09,26.04 | T53.B 196.29,23.89
  Bottom 0.305: R33.2 200.26,19.29
N$119
  Bottom 0.203: 195.58,29.21 200.66,29.21
  Bottom 0.254: 201.06,19.13 203.84,21.91 203.84,26.19 200.66,29.21
  Bottom 0.305: R33.3 201.06,19.13 | T54.B 195.58,29.21
N$120
  Bottom 0.203: 196.85,34.92 201.77,32.23
  Bottom 0.254: 201.94,19.05 204.47,21.59 204.47,26.67 201.77,29.37 201.77,32.23 | T55.B 196.85,34.92
  Bottom 0.305: R33.4 201.94,19.05
N$121
  Bottom 0.203: 200.34,39.45 203.68,34.85
  Bottom 0.254: T56.B 200.34,39.45 | 203.99,20.16 205.1,21.27 205.1,26.99 203.68,28.42 203.68,34.85
  Bottom 0.305: R34.1 203.99,20.16
N$122
  Bottom 0.203: 211.3,41.91 209.87,36.2
  Bottom 0.254: 204.86,20.08 212.09,27.3 212.09,31.75 209.87,33.97 209.87,36.2
  Bottom 0.305: T57.B 211.3,41.91 | R34.2 204.86,20.08
N$123
  Bottom 0.203: 216.53,39.21 212.88,35.08
  Bottom 0.254: 205.66,19.93 212.72,26.99 212.72,34.92 212.88,35.08 | T58.B 216.53,39.21
  Bottom 0.305: R34.3 205.66,19.93
N$124
  Bottom 0.203: 220.03,34.61 214.63,32.38
  Bottom 0.254: R35.1 208.43,21.74 214.63,27.94 214.63,32.38 | T59.B 220.03,34.61
N$125
  Bottom 0.203: 220.82,29.21 215.42,29.21
  Bottom 0.254: R35.2 209.31,21.67 215.42,27.78 215.42,29.21
  Bottom 0.305: T60.B 220.82,29.21
N$126
  Bottom 0.203: 220.03,23.81 214.63,26.04
  Bottom 0.254: R35.3 210.11,21.51 214.63,26.04 | T51.B 220.03,23.81
N$127
  Bottom 0.406: R30.8 167.63,16.5 167,15.88 IC5.1
N$128
  Bottom 0.406: R30.7 168.51,16.11 168.28,15.88 IC5.2
N$129
  Bottom 0.406: R30.6 169.31,16.11 169.54,15.88 IC5.3
N$130
  Bottom 0.406: R30.5 170.19,16.5 170.81,15.88 IC5.4
N$131
  Bottom 0.406: R31.8 172.4,16.19 172.09,15.88 IC5.5
N$132
  Bottom 0.406: R31.7 173.27,15.96 173.35,15.88 IC5.6
N$133
  Bottom 0.406: R31.6 174.07,16.43 174.62,15.88 IC5.7
N$134
  Bottom 0.406: IC5.9 175.9,9.53 178.36,11.99 R32.6
N$135
  Bottom 0.406: R32.8 176.68,12.85 173.35,9.53 IC5.11
N$136
  Bottom 0.406: IC5.10 174.62,9.53 177.56,12.46 R32.7
N$137
  Bottom 0.406: R33.6 201.06,16.11 201.29,15.88 IC6.3
N$138
  Bottom 0.406: R33.8 199.38,16.5 198.75,15.88 IC6.1
N$139
  Bottom 0.406: R33.7 200.26,16.11 200.03,15.88 IC6.2
N$140
  Bottom 0.406: R35.8 208.43,12.85 205.1,9.53 IC6.11
N$141
  Bottom 0.406: R35.6 210.11,11.99 207.65,9.53 IC6.9
N$142
  Bottom 0.406: R35.7 209.31,12.46 206.38,9.53 IC6.10
N$143
  Bottom 0.406: R33.5 201.94,16.5 202.56,15.88 IC6.4
N$144
  Bottom 0.406: R34.8 203.99,16.03 203.84,15.88 IC6.5
N$145
  Bottom 0.406: R34.7 204.86,16.12 205.1,15.88 IC6.6
N$146
  Bottom 0.406: R34.6 205.66,16.59 206.38,15.88 IC6.7
N$147
  Bottom 0.61: T63.C N5.K
N$148
  Bottom 0.61: T64.C N6.K
N$149
  Bottom 0.61: T65.C N7.K
N$150
  Bottom 0.61: T66.C N8.K
N$151
  Bottom 0.61: T67.C N9.K
N$152
  Bottom 0.61: T68.C N10.K
N$153
  Bottom 0.61: T69.C N11.K
N$154
  Bottom 0.61: R36.1 N5.A
N$155
  Bottom 0.61: R37.1 N6.A
N$156
  Bottom 0.61: R39.1 N8.A
N$157
  Bottom 0.61: R42.1 N11.A
N$158
  Bottom 0.61: R41.1 N10.A
N$159
  Bottom 0.61: R40.1 N9.A
N$160
  Bottom 0.61: R38.1 N7.A
N$161
  Bottom 0.61: R23.1 46.97,51.41 45.72,50.16 R11.1
N$162
  Bottom 0.61: R23.3 49.55,48.91 50.8,50.16 50.8,52.07 49.84,53.02 R12.2
N$163
  Bottom 0.305: R43.8 152.71,55.88 152.08,56.52 IC9.1
N$164
  Bottom 0.305: R43.7 152.63,55.01 152.4,55.24 IC9.2
N$165
  Bottom 0.305: R43.6 152.63,54.21 152.4,53.98 IC9.3
N$166
  Bottom 0.305: R43.5 152.71,53.34 152.08,52.7 IC9.4
N$167
  Bottom 0.305: R44.6 152.95,50.4 151.45,48.9 IC9.7
N$168
  Bottom 0.305: R44.8 152.72,52.08 152.08,51.44 IC9.5
N$169
  Bottom 0.305: R44.7 152.8,51.2 151.76,50.16 IC9.6
N$170  (via drill 3.2)
  other vias: 225.11,58.74
N$171  (via drill 3.2)
  other vias: 4.92,5.71
N$172  (via drill 3.2)
  other vias: 225.11,5.71
N$173  (via drill 3.2)
  other vias: 4.92,58.74
N$174
  pour Top (isolate 1.016): 0,63.5 229.87,63.5 229.87,0 0,0
QS18_1_0
  Bottom 0.305: TUBE1.0 28.56,23.69 T1.C
QS18_1_1
  Bottom 0.305: T2.C TUBE1.1 | TUBE1.1
QS18_1_2
  Bottom 0.305: TUBE1.2 12.93,27.21 T3.C
QS18_1_3
  Bottom 0.305: TUBE1.3 | TUBE1.3 T4.C
QS18_1_4
  Bottom 0.305: TUBE1.4 14.62,34.73 T5.C
QS18_1_5
  Bottom 0.305: TUBE1.5 T6.C
QS18_1_6
  Bottom 0.305: TUBE1.6 25.43,37.23 T7.C
QS18_1_7
  Bottom 0.305: TUBE1.7 | TUBE1.7 T8.C
QS18_1_8
  Bottom 0.305: TUBE1.8 30.25,31.21 T9.C
QS18_1_9
  Bottom 0.305: TUBE1.9 | TUBE1.9 T10.C
QS18_2_0  (1 unrouted)
  Bottom 0.406: T11.C 60.31,23.69
QS18_2_1
  Bottom 0.406: TUBE2.1 | T12.C TUBE2.1
QS18_2_2
  Bottom 0.406: T13.C 44.68,27.21 TUBE2.2
QS18_2_3
  Bottom 0.406: TUBE2.3 | TUBE2.3 T14.C
QS18_2_4
  Bottom 0.406: TUBE2.4 46.37,34.73 T15.C
QS18_2_5
  Bottom 0.406: TUBE2.5 T16.C
QS18_2_6
  Bottom 0.406: TUBE2.6 57.18,37.23 T17.C
QS18_2_7
  Bottom 0.406: T18.C TUBE2.7 | TUBE2.7
QS18_2_8
  Bottom 0.406: TUBE2.8 62,31.21 T19.C
QS18_2_9
  Bottom 0.406: T20.C TUBE2.9 | TUBE2.9
QS18_3_0
  Bottom 0.254: TUBE3.0 106.03,23.69 T21.C
QS18_3_1
  Bottom 0.254: T22.C TUBE3.1 | TUBE3.1
QS18_3_2
  Bottom 0.254: TUBE3.2 90.4,27.21 T23.C
QS18_3_3
  Bottom 0.254: TUBE3.3 | TUBE3.3 T24.C
QS18_3_4
  Bottom 0.254: TUBE3.4 92.09,34.73 T25.C
QS18_3_5
  Bottom 0.254: TUBE3.5 T26.C
QS18_3_6
  Bottom 0.254: T27.C 102.9,37.23 TUBE3.6
QS18_3_7
  Bottom 0.254: T28.C TUBE3.7 | TUBE3.7
QS18_3_8
  Bottom 0.254: 107.72,31.21 T29.C | TUBE3.8 107.72,31.21 | 107.72,31.21 107.51,32.14
QS18_3_9
  Bottom 0.254: TUBE3.9 | TUBE3.9 T30.C
QS18_4_0
  Bottom 0.254: T31.C 137.78,23.69 TUBE4.0
QS18_4_1
  Bottom 0.254: TUBE4.1 | T32.C TUBE4.1
QS18_4_2
  Bottom 0.254: TUBE4.2 122.15,27.21 T33.C
QS18_4_3
  Bottom 0.254: TUBE4.3 | TUBE4.3 T34.C
QS18_4_4
  Bottom 0.254: TUBE4.4 123.84,34.73 T35.C
QS18_4_5
  Bottom 0.254: TUBE4.5 T36.C
QS18_4_6
  Bottom 0.254: T37.C 134.65,37.23 TUBE4.6
QS18_4_7
  Bottom 0.254: T38.C TUBE4.7 | TUBE4.7
QS18_4_8  (1 unrouted)
  Bottom 0.254: 139.47,31.21 T39.C
QS18_4_9
  Bottom 0.254: T40.C TUBE4.9 | TUBE4.9
QS18_5_0
  Bottom 0.254: 183.5,23.69 TUBE5.0 | 184.09,24.43 183.5,23.69 | 183.5,23.69 T41.C
QS18_5_1
  Bottom 0.254: TUBE5.1 | TUBE5.1 T42.C | TUBE5.1 170.18,22.92
QS18_5_2
  Bottom 0.254: TUBE5.2 167.87,27.21 | 167.87,27.21 T43.C | 168.08,26.28 167.87,27.21
QS18_5_3
  Bottom 0.254: 167.65,30.25 TUBE5.3 | TUBE5.3 | TUBE5.3 T44.C
QS18_5_4
  Bottom 0.254: 168.97,33.99 169.56,34.73 | 169.56,34.73 TUBE5.4 | 169.56,34.73 T45.C
QS18_5_5
  Bottom 0.254: 171.8,36.8 TUBE5.5 T46.C
QS18_5_6
  Bottom 0.254: T47.C 180.37,37.23 | 180.37,37.23 179.51,37.64 | 180.37,37.23 TUBE5.6
QS18_5_7
  Bottom 0.254: TUBE5.7 T48.C | TUBE5.7 | TUBE5.7 182.88,35.5
QS18_5_8
  Bottom 0.254: TUBE5.8 185.19,31.21 | 185.19,31.21 T49.C | 185.19,31.21 184.98,32.14
QS18_5_9
  Bottom 0.254: TUBE5.9 | TUBE5.9 T50.C | TUBE5.9 185.41,28.17
QS18_6_0
  Bottom 0.254: 215.25,23.69 T51.C | 215.25,23.69 215.84,24.43 | 215.25,23.69 TUBE6.0
QS18_6_1
  Bottom 0.254: T52.C TUBE6.1 | TUBE6.1 | 201.93,22.92 TUBE6.1
QS18_6_2
  Bottom 0.254: T53.C 199.62,27.21 | 199.62,27.21 TUBE6.2 | 199.83,26.28 199.62,27.21
QS18_6_3
  Bottom 0.254: TUBE6.3 T54.C | TUBE6.3 | TUBE6.3 199.4,30.25
QS18_6_4
  Bottom 0.254: 201.31,34.73 T55.C | 201.31,34.73 200.72,33.99 | 201.31,34.73 TUBE6.4
QS18_6_5
  Bottom 0.254: TUBE6.5 T56.C
QS18_6_6
  Bottom 0.254: T57.C 212.12,37.23 | 212.12,37.23 TUBE6.6 | 212.12,37.23 211.26,37.64
QS18_6_7
  Bottom 0.254: TUBE6.7 T58.C | TUBE6.7 | TUBE6.7 214.63,35.5
QS18_6_8
  Bottom 0.254: 216.94,31.21 T59.C | 216.94,31.21 216.73,32.14 | 216.94,31.21 TUBE6.8
QS18_6_9
  Bottom 0.254: TUBE6.9 T60.C | TUBE6.9 217.16,28.17 | TUBE6.9
RST4017  (via drill 0.6 pad 1.42)
  Top 0.305: v214.63,11.43 v196.85,11.43
  Top 0.406: v8.89,11.43 v41.91,11.43 v87.63,11.43 v119.38,11.43 v165.1,11.43 v196.85,11.43
  Bottom 0.305: v214.63,11.43 219.71,11.43 224.16,15.88 224.16,36.2 219.07,41.27 219.07,52.39 217.49,53.98 209.55,53.98 208.91,54.61 200.98,54.61 200.34,55.24 192.41,55.24 191.77,55.88 183.83,55.88 183.2,56.52 175.26,56.52 174.62,57.15 167,57.15 166.37,57.78 147.96,57.78 145.41,55.24 IC9.15 142.72,55.24 141.6,54.13 141.6,51.28 137.64,47.31 124.94,47.31 122.56,44.93 120.65,44.93 119.24,46.34 MCU1.3
  Bottom 0.406: IC6.15 200.03,9.53 198.12,11.43 v196.85,11.43 | v8.89,11.43 11.43,11.43 13.34,9.53 IC1.15 | IC2.15 45.09,9.53 43.18,11.43 v41.91,11.43 | IC3.15 90.81,9.53 88.9,11.43 v87.63,11.43 | IC4.15 122.56,9.53 120.65,11.43 v119.38,11.43 | IC5.15 168.28,9.53 166.37,11.43 v165.1,11.43
SCK
  Bottom 0.406: MCU1.18 106.05,54.14 104.78,52.86 96.05,52.87 95.89,52.7 U$1.7
SD
  Bottom 0.406: R45.1 125.57,55.56 124.95,54.94 MCU1.37
  Bottom 0.508: R45.1 U$4.3
SDIN
  Bottom 0.406: MCU1.19 105.58,54.94 104.3,53.66 96.19,53.67 95.89,53.98 U$1.6